# Altium schematic sheet RFID.SchDoc
size A4; SheetNumber: 2; SheetTotal: 3
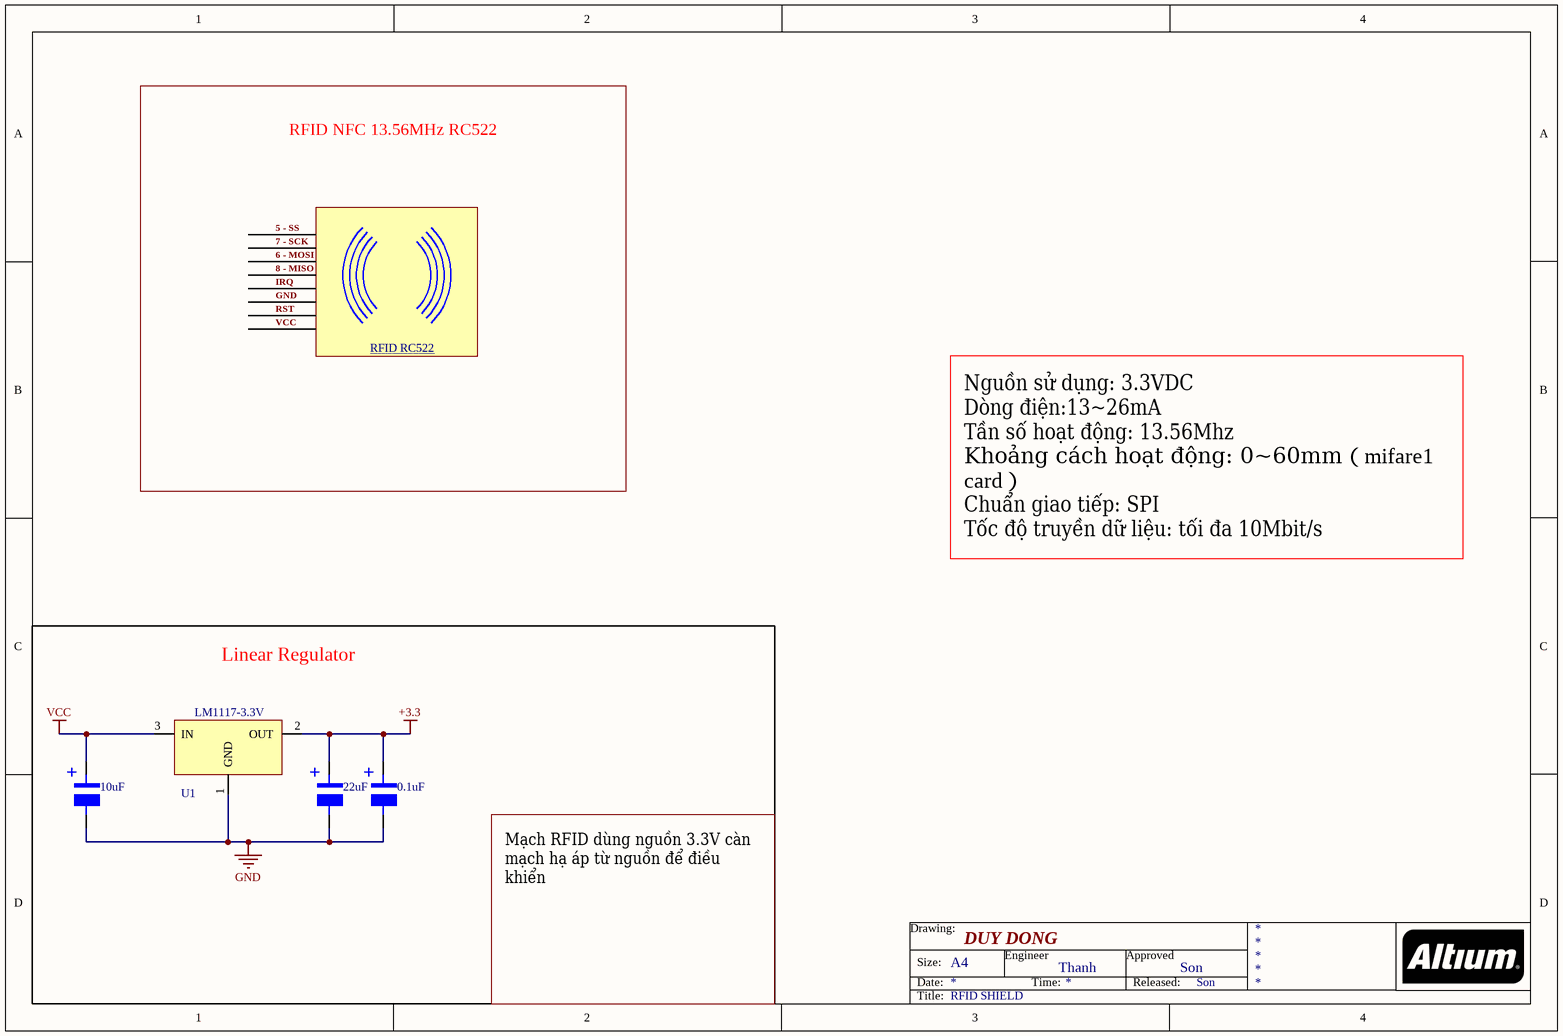
[diagram p0: RFID.SchDoc]

## Parts
C1  10uF  [Cap220uF]
C2  22uF  [Cap220uF]
C3  0.1uF  [Cap220uF]
U1  LM1117-3.3V  [SOT223-4N]

## Blocks framed on the sheet
Linear Regulator: C1-C3 U1

## Nets
+3.3: C2.1 C3.1 U1.2(OUT)
GND: C1.2 C2.2 C3.2 U1.1(GND)
VCC: C1.1 U1.3(IN)

## Notes on the sheet
- RFID NFC 13.56MHz RC522
- RFID RC522
- Nguồn sử dụng: 3.3VDC
  Dòng điện:13~26mA
  Tần số hoạt động: 13.56Mhz
  Khoảng cách hoạt động: 0~60mm（mifare1 card）
  Chuẩn giao tiếp: SPI
  Tốc độ truyền dữ liệu: tối đa 10Mbit/s
- Mạch RFID dùng nguồn 3.3V càn mạch hạ áp từ nguồn để điều khiển
- Labels drawn without touching a wire or pin: 5 - SS, 6 - MOSI, 7 - SCK, 8 - MISO, GND, IRQ, RST, VCC
- Drawing:
- Size:
- Date:
- A4
- DUY DONG
- Engineer
- Time:
- Thanh
- Approved
- Released:
- Son
- Title:
- RFID SHIELD
- (in symbol Cap220uF) +

## Library data of the parts
C1-C3 = Cap220uF: 220uF: 220uF
U1 = LM1117: 800mA Low-Dropout Linear Regulator; Creator: Nguyen Ba Bien; Website: http://group3i.net